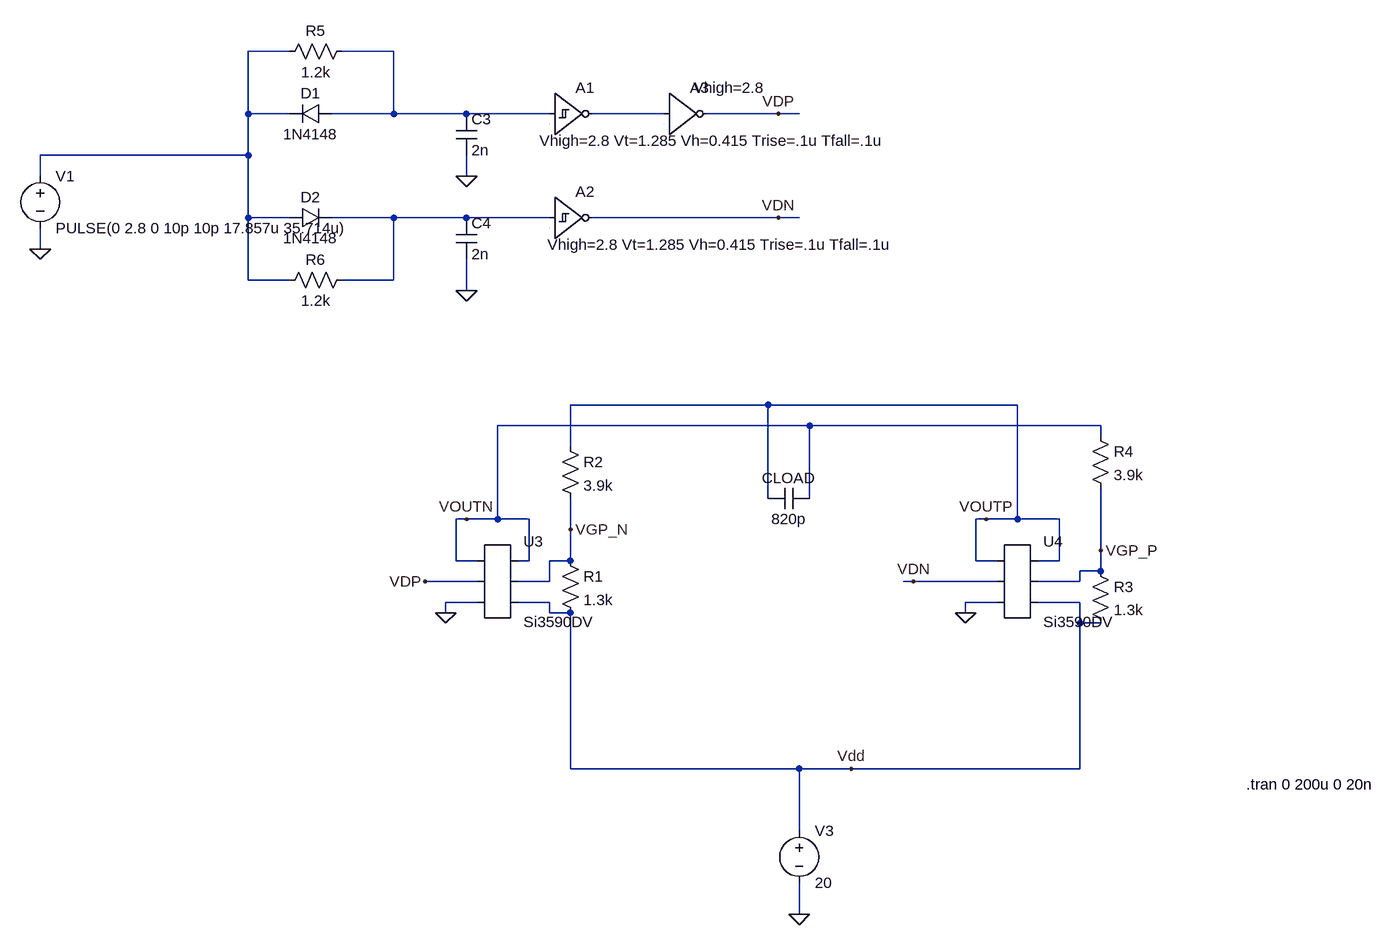
[diagram p0: schematic HbridgePiezo.asc]
HbridgePiezo.asc, the LTspice schematic file:
Version 4
SHEET 1 1068 680
WIRE -736 -736 -800 -736
WIRE -576 -736 -656 -736
WIRE -800 -640 -800 -736
WIRE -736 -640 -800 -640
WIRE -576 -640 -576 -736
WIRE -576 -640 -672 -640
WIRE -464 -640 -576 -640
WIRE -336 -640 -464 -640
WIRE -160 -640 -272 -640
WIRE 16 -640 -96 -640
WIRE 48 -640 16 -640
WIRE -800 -576 -800 -640
WIRE -800 -576 -1120 -576
WIRE -1120 -544 -1120 -576
WIRE -464 -544 -464 -576
WIRE -800 -480 -800 -576
WIRE -736 -480 -800 -480
WIRE -576 -480 -672 -480
WIRE -464 -480 -576 -480
WIRE -336 -480 -464 -480
WIRE 16 -480 -272 -480
WIRE 48 -480 16 -480
WIRE -1120 -432 -1120 -464
WIRE -800 -384 -800 -480
WIRE -736 -384 -800 -384
WIRE -576 -384 -576 -480
WIRE -576 -384 -656 -384
WIRE -464 -368 -464 -416
WIRE 0 -192 -304 -192
WIRE 384 -192 0 -192
WIRE 64 -160 -416 -160
WIRE 512 -160 64 -160
WIRE 512 -144 512 -160
WIRE -304 -128 -304 -192
WIRE 0 -48 0 -192
WIRE 64 -48 64 -160
WIRE -464 -16 -480 -16
WIRE -416 -16 -416 -160
WIRE -416 -16 -464 -16
WIRE -368 -16 -416 -16
WIRE 336 -16 320 -16
WIRE 384 -16 384 -192
WIRE 384 -16 336 -16
WIRE 448 -16 384 -16
WIRE -304 0 -304 -48
WIRE 512 32 512 -64
WIRE -480 48 -480 -16
WIRE -448 48 -480 48
WIRE -368 48 -368 -16
WIRE -368 48 -384 48
WIRE -304 48 -304 0
WIRE -304 48 -336 48
WIRE 320 48 320 -16
WIRE 352 48 320 48
WIRE 448 48 448 -16
WIRE 448 48 416 48
WIRE 512 64 512 32
WIRE 512 64 480 64
WIRE -448 80 -528 80
WIRE -336 80 -336 48
WIRE -336 80 -384 80
WIRE 224 80 208 80
WIRE 352 80 224 80
WIRE 480 80 480 64
WIRE 480 80 416 80
WIRE -448 112 -496 112
WIRE -336 112 -384 112
WIRE 352 112 304 112
WIRE 480 112 416 112
WIRE -496 128 -496 112
WIRE -336 128 -336 112
WIRE -304 128 -336 128
WIRE 304 128 304 112
WIRE 480 144 480 112
WIRE 512 144 480 144
WIRE -304 368 -304 128
WIRE 48 368 -304 368
WIRE 128 368 48 368
WIRE 480 368 480 144
WIRE 480 368 128 368
WIRE 48 464 48 368
WIRE 48 592 48 544
FLAG 48 592 0
FLAG -496 128 0
FLAG 304 128 0
FLAG 128 368 Vdd
FLAG -528 80 VDP
FLAG 224 80 VDN
FLAG 336 -16 VOUTP
FLAG -464 -16 VOUTN
FLAG -304 0 VGP_N
FLAG 512 32 VGP_P
FLAG -464 -544 0
FLAG -464 -368 0
FLAG -1120 -432 0
FLAG 16 -640 VDP
FLAG 16 -480 VDN
SYMBOL voltage -1120 -560 R0
WINDOW 123 0 0 Left 2
WINDOW 39 0 0 Left 2
SYMATTR InstName V1
SYMATTR Value PULSE(0 2.8 0 10p 10p 17.857u 35.714u)
SYMBOL voltage 48 448 R0
WINDOW 123 0 0 Left 2
WINDOW 39 0 0 Left 2
SYMATTR InstName V3
SYMATTR Value 20
SYMBOL res -320 32 R0
SYMATTR InstName R1
SYMATTR Value 1.3k
SYMATTR SpiceLine tol=5
SYMBOL res -320 -144 R0
SYMATTR InstName R2
SYMATTR Value 3.9k
SYMATTR SpiceLine tol=5
SYMBOL res 496 48 R0
SYMATTR InstName R3
SYMATTR Value 1.3k
SYMATTR SpiceLine tol=5
SYMBOL res 496 -160 R0
SYMATTR InstName R4
SYMATTR Value 3.9k
SYMATTR SpiceLine tol=5
SYMBOL diode -672 -656 R90
WINDOW 0 0 32 VBottom 2
WINDOW 3 32 32 VTop 2
SYMATTR InstName D1
SYMATTR Value 1N4148
SYMBOL diode -736 -464 R270
WINDOW 0 32 32 VTop 2
WINDOW 3 0 32 VBottom 2
SYMATTR InstName D2
SYMATTR Value 1N4148
SYMBOL res -640 -752 R90
WINDOW 0 0 56 VBottom 2
WINDOW 3 32 56 VTop 2
SYMATTR InstName R5
SYMATTR Value 1.2k
SYMATTR SpiceLine tol=5
SYMBOL res -640 -400 R90
WINDOW 0 0 56 VBottom 2
WINDOW 3 32 56 VTop 2
SYMATTR InstName R6
SYMATTR Value 1.2k
SYMATTR SpiceLine tol=5
SYMBOL cap -480 -640 R0
SYMATTR InstName C3
SYMATTR Value 2n
SYMBOL cap -480 -480 R0
SYMATTR InstName C4
SYMATTR Value 2n
SYMBOL Digital\\schmtinv -336 -704 R0
WINDOW 3 -16 105 Left 2
SYMATTR Value Vhigh=2.8 Vt=1.285 Vh=0.415 Trise=.1u Tfall=.1u
SYMATTR InstName A1
SYMBOL Digital\\schmtinv -336 -544 R0
WINDOW 3 -3 105 Left 2
SYMATTR Value Vhigh=2.8 Vt=1.285 Vh=0.415 Trise=.1u Tfall=.1u
SYMATTR InstName A2
SYMBOL Digital\\inv -160 -704 R0
WINDOW 3 45 24 Left 2
SYMATTR Value Vhigh=2.8
SYMATTR InstName A3
SYMBOL AutoGenerated\\Si3590DV -416 80 R0
SYMATTR InstName U3
SYMBOL AutoGenerated\\Si3590DV 384 80 R0
SYMATTR InstName U4
SYMBOL cap 64 -64 R90
WINDOW 0 0 32 VBottom 2
WINDOW 3 32 32 VTop 2
SYMATTR InstName CLOAD
SYMATTR Value 820p
TEXT 736 392 Left 2 !.tran 0 200u 0 20n

The netlist it stands for:
* HbridgePiezo.asc
V1 N001 0 PULSE(0 2.8 0 10p 10p 17.857u 35.714u)
V3 Vdd 0 20
R1 VGP_N Vdd 1.3k tol=5
R2 VOUTP VGP_N 3.9k tol=5
R3 VGP_P Vdd 1.3k tol=5
R4 VOUTN VGP_P 3.9k tol=5
D1 N002 N001 1N4148
D2 N001 N004 1N4148
R5 N002 N001 1.2k tol=5
R6 N004 N001 1.2k tol=5
C3 N002 0 2n
C4 N004 0 2n
A1 N002 0 0 0 0 N003 0 0 SCHMITT Vhigh=2.8 Vt=1.285 Vh=0.415 Trise=.1u Tfall=.1u
A2 N004 0 0 0 0 VDN 0 0 SCHMITT Vhigh=2.8 Vt=1.285 Vh=0.415 Trise=.1u Tfall=.1u
A3 N003 0 0 0 0 VDP 0 0 BUF Vhigh=2.8
* U3: Si3590DV (symbol AutoGenerated\Si3590DV not available, pins judged from their places): pin1=VOUTN pin2=VDP pin3=0 pin4=VOUTN pin5=VGP_N pin6=Vdd
* U4: Si3590DV (symbol AutoGenerated\Si3590DV not available, pins judged from their places): pin1=VOUTP pin2=VDN pin3=0 pin4=VOUTP pin5=VGP_P pin6=Vdd
CLOAD VOUTN VOUTP 820p
.model D D
.lib standard.dio
.tran 0 200u 0 20n
.backanno
.end